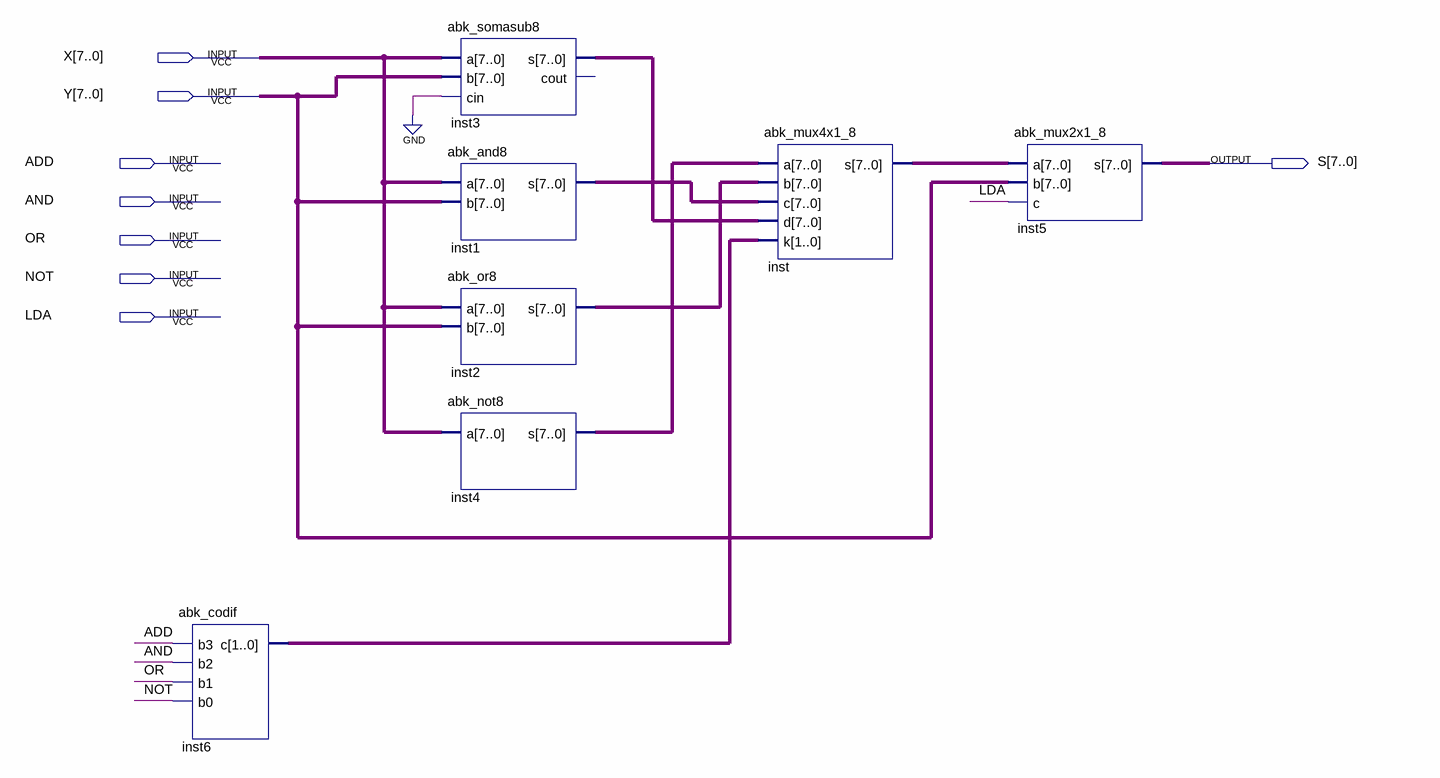
[diagram p0: schematic sheet]
// Quartus schematic abk_ula_neander.bdf as structural Verilog: 7 symbols, 8 pins
module abk_ula_neander (
  input  [7:0] X,
  input  [7:0] Y,
  input  ADD,
  input  AND,
  input  OR,
  input  NOT,
  input  LDA,
  output [7:0] S
);

  wire [1:0] inst6_c;
  wire [7:0] inst1_s, inst2_s, inst3_s, inst4_s, inst_s;

  abk_codif inst6 (.b3(ADD), .b2(AND), .b1(OR), .b0(NOT), .c(inst6_c));
  abk_somasub8 inst3 (.a(X), .b(Y), .cin(1'b0), .s(inst3_s));  // open: cout
  abk_and8 inst1 (.a(X), .b(Y), .s(inst1_s));
  abk_or8 inst2 (.a(X), .b(Y), .s(inst2_s));
  abk_not8 inst4 (.a(X), .s(inst4_s));
  abk_mux4x1_8 inst (.a(inst4_s), .b(inst2_s), .c(inst1_s), .d(inst3_s), .k(inst6_c), .s(inst_s));
  abk_mux2x1_8 inst5 (.a(inst_s), .b(Y), .c(LDA), .s(S));
endmodule
